# EAGLE schematic Measure Temperature (EAGLE 9.6.2)
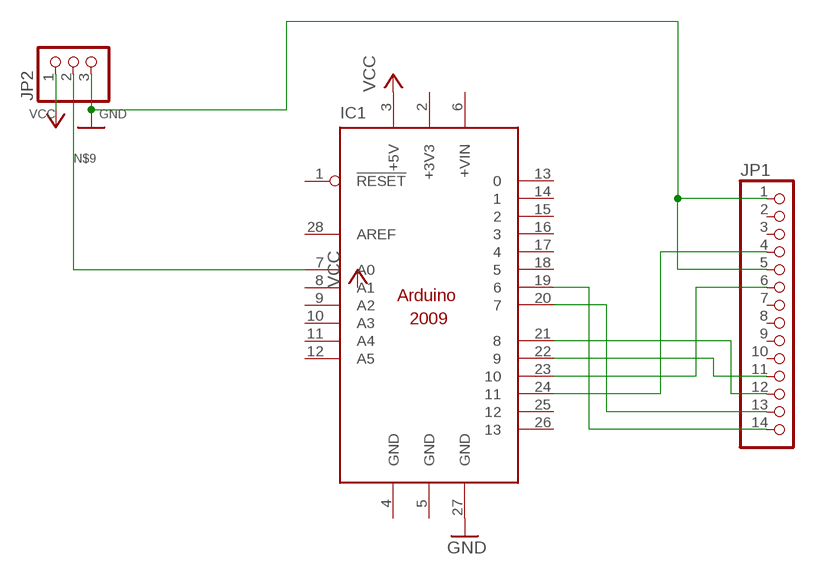
[diagram p0: schematic, sheet 1]

## Parts
IC1  ARDUINO2009_12  [ARDUINO2009_2]
JP1  PINHD-1X14  [1X14]
JP2  PINHD-1X3  [1X03]

## Nets
GND: IC1.27(GND) JP1.1 JP1.5 JP2.3
N$1: IC1.19 JP1.14
N$2: IC1.20 JP1.13
N$3: IC1.21 JP1.12
N$4: IC1.22 JP1.11
N$5: IC1.23 JP1.6
N$6: IC1.24 JP1.4
N$9: IC1.7(A0) JP2.2
VCC: IC1.3(+5V) JP2.1
Unconnected: IC1.1(!RESET) IC1.6(+VIN) IC1.8(A1) IC1.9(A2) IC1.10(A3) IC1.11(A4) IC1.12(A5) IC1.13 IC1.14 IC1.15 IC1.16 IC1.17 IC1.18 IC1.25 IC1.26 IC1.28(AREF) JP1.2 JP1.3 JP1.7 JP1.8 JP1.9 JP1.10

## Power pins joined to a net without a drawn wire
+3V3: IC1.2(+3V3)
GND: IC1.4(GND) IC1.5(GND)

## Library data of the parts
IC1 = arduino:ARDUINO2009_1: The Arduino Duemilanove ("2009") is a microcontroller board based on the ATmega168 or ATmega328. - 14 digital input/output pins (of which 6 can be used as PWM outputs) - 6 analog inputs, a 16 MHz crystal oscillator - USB connection - power jack - ISP header - reset button It contains everything needed to support the microcontroller; simply connect it to a computer with a USB cable or power it with a AC-to-DC adapter or battery to get started http://arduino.cc/en/Main/ArduinoBoardDuemilanove
JP1 = pinhead:PINHD-1X14: PIN HEADER
JP2 = pinhead:PINHD-1X3: PIN HEADER